# Altium schematic sheet Band Pass Filter.SchDoc
size 431 x 279 mm; Organization: ORGANIZATION; Address1: ADDRESS 1; Address2: ADDRESS 2; Address3: ADDRESS 3; Address4: ADDRESS 4; Revision: -; SheetNumber: 2; SheetTotal: 4; ENG_APP_DATE: --/--/--; DSN_APP_DATE: --/--/--; CHK_APP_DATE: --/--/--
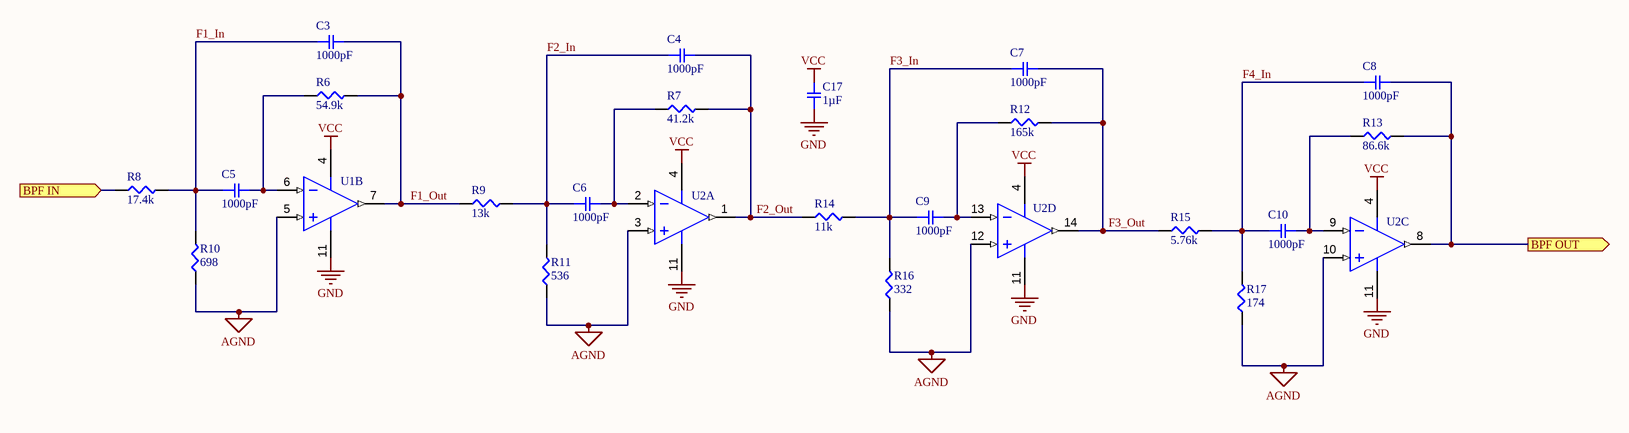
[diagram p0: Band Pass Filter.SchDoc]

## Parts
C3  1000pF  [SMD-0603C]
C4  1000pF  [SMD-0603C]
C5  1000pF  [SMD-0603C]
C6  1000pF  [SMD-0603C]
C7  1000pF  [SMD-0603C]
C8  1000pF  [SMD-0603C]
C9  1000pF  [SMD-0603C]
C10  1000pF  [SMD-0603C]
C17  1µF  [SMD-0603C]
R6  54.9k  [SMD-0603-RES]
R7  41.2k  [SMD-0603-RES]
R8  17.4k  [SMD-0603-RES]
R9  13k  [SMD-0603-RES]
R10  698  [SMD-0603-RES]
R11  536  [SMD-0603-RES]
R12  165k  [SMD-0603-RES]
R13  86.6k  [SMD-0603-RES]
R14  11k  [SMD-0603-RES]
R15  5.76k  [SMD-0603-RES]
R16  332  [SMD-0603-RES]
R17  174  [SMD-0603-RES]
U1  OPA1604AIPWR  [PW0014A_N]  (value not drawn)  (part B of 4)
U2  OPA1604AIPWR  [PW0014A_N]  (value not drawn)  (parts A,C,D of 4)

## Ports
BPF IN (in), BPF OUT (out)

## Nets
AGND: R10.1 R11.1 R16.1 R17.1 U1.5(IN_B+) U2.3(IN_A+) U2.10(IN_C+) U2.12(IN_D+)
GND: C17.1 U1.11(V-) U2.11(V-)
VCC: C17.2 U1.4(V+) U2.4(V+)
BPF IN: R8.1 ; port BPF IN
BPF OUT: C8.2 R13.2 U2.8(OUT_C) ; port BPF OUT
F1_In: C3.1 C5.1 R8.2 R10.2
F1_Out: C3.2 R6.2 R9.1 U1.7(OUT_B)
F2_In: C4.1 C6.1 R9.2 R11.2
F2_Out: C4.2 R7.2 R14.1 U2.1(OUT_A)
F3_In: C7.1 C9.1 R14.2 R16.2
F3_Out: C7.2 R12.2 R15.1 U2.14(OUT_D)
F4_In: C8.1 C10.1 R15.2 R17.2
NetC5_2: C5.2 R6.1 U1.6(IN_B-)
NetC6_2: C6.2 R7.1 U2.2(IN_A-)
NetC9_2: C9.2 R12.1 U2.13(IN_D-)
NetC10_2: C10.2 R13.1 U2.9(IN_C-)

## Notes on the sheet
- DWG. NO.
- REV.
- SHT.
- THIS DOCUMENT AND THE DATA DISCLOSED HEREIN OR HEREWITH IS THE PROPERTY OF ALTIUM LIMITED AND MAY BE FREELY DISTRIBUTED IN WHOLE. NO RIGHTS ARE RESERVED OR EXPRESS OR IMPLIED WARANTEE GIVEN.
- REVISION
- DESCRIPTION
- DATE
- APPROVED
- ENG:
- APPROVALS
- PROJECT
- DSN:
- CHK:
- REFERENCE DOCUMENTS
- PROJECT REVISION:
- TITLE
- DOCUMENT REVISION:
- DESIGN ITEM:
- BOM:
- FAB DWG:
- PCB DWG:
- ASSY DWG:
- SCALE:
- SIZE
- B
- CAGE CODE
- FILE NAME
- DWG NO.
- SHEET
- OF
- REV

## Library data of the parts
C3-C10 = GCJ188R71H102KA01D: CAP CER 1000PF 50V X7R 0603; Manufacturer: Walsin Technology Corporation; Manufacturer Part Number: 0603N102F500CT; Value: 1000pF; Operating Temperature: -55°C ~ 125°C; Package / Case: 0603 (1608 Metric); Datasheet Link: https://www.digikey.com/en/products/detail/walsin-technology-corporation/0603N102F500CT/9354972
C17 = GCM188R71C105KA64D: CAP CER 1UF 16V X7R 0603; Manufacturer: Samsung Electro-Mechanics; Manufacturer Part Number: CL10A105KA8NNNC; Value: 1µF; Operating Temperature: -55°C ~ 125°C; Package / Case: 0603 (1608 Metric); Datasheet Link: https://www.digikey.com/en/products/detail/samsung-electro-mechanics/CL10A105KA8NNNC/3886760
R6 = ERJ-3EKF5492V: RES SMD 54.9K OHM 1% 1/10W 0603; Manufacturer: Panasonic Electronic Components; Value: 54.9k; Operating Temperature: -55°C ~ 155°C; Package / Case: 0603 (1608 Metric); Datasheet Link: https://www.digikey.com/en/products/detail/panasonic-electronic-components/ERJ-3EKF5492V/196403; Manufacturer Part Number: ERJ-3EKF5492V
R7 = ERJ-3EKF4122V: RES SMD 41.2K OHM 1% 1/10W 0603; Manufacturer: Panasonic Electronic Components; Value: 41.2k; Operating Temperature: -55°C ~ 155°C; Package / Case: 0603 (1608 Metric); Datasheet Link: https://www.digikey.com/en/products/detail/yageo/RC0603FR-0741K2L/727225; Manufacturer Part Number: ERJ-3EKF4122V
R8 = ERJ-3EKF1742V: RES SMD 17.4K OHM 1% 1/10W 0603; Manufacturer: Panasonic Electronic Components; Value: 17.4k; Operating Temperature: -55°C ~ 155°C; Package / Case: 0603 (1608 Metric); Datasheet Link: https://www.digikey.com/en/products/detail/panasonic-electronic-components/ERJ-3EKF1742V/196159; Manufacturer Part Number: ERJ-3EKF1742V
R9 = ERJ-3EKF1302V: RES SMD 13K OHM 1% 1/10W 0603; Manufacturer: Panasonic Electronic Components; Value: 13k; Operating Temperature: -55°C ~ 155°C; Package / Case: 0603 (1608 Metric); Datasheet Link: https://www.digikey.com/en/products/detail/panasonic-electronic-components/ERJ-3EKF1302V/196110; Manufacturer Part Number: ERJ-3EKF1302V
R10 = ERJ-3EKF6980V: RES SMD 698 OHM 1% 1/10W 0603; Manufacturer: Panasonic Electronic Components; Value: 698; Operating Temperature: -55°C ~ 155°C; Package / Case: 0603 (1608 Metric); Datasheet Link: https://www.digikey.com/en/products/detail/panasonic-electronic-components/ERJ-3EKF6980V/196453; Manufacturer Part Number: ERJ-3EKF6980V
R11 = ERJ-3EKF5360V: RES SMD 536 OHM 1% 1/10W 0603; Manufacturer: Panasonic Electronic Components; Value: 536; Operating Temperature: -55°C ~ 155°C; Package / Case: 0603 (1608 Metric); Datasheet Link: https://www.digikey.com/en/products/detail/panasonic-electronic-components/ERJ-3EKF5360V/196400; Manufacturer Part Number: ERJ-3EKF5360V
R12 = ERJ-3EKF1653V: RES SMD 165K OHM 1% 1/10W 0603; Manufacturer: Panasonic Electronic Components; Value: 165k; Operating Temperature: -55°C ~ 155°C; Package / Case: 0603 (1608 Metric); Datasheet Link: https://www.digikey.com/en/products/detail/panasonic-electronic-components/ERJ-3EKF1653V/196155; Manufacturer Part Number: ERJ-3EKF1653V
R13 = ERJ-3EKF8662V: RES SMD 86.6K OHM 1% 1/10W 0603; Manufacturer: Panasonic Electronic Components; Value: 86.6k; Operating Temperature: -55°C ~ 155°C; Package / Case: 0603 (1608 Metric); Datasheet Link: https://www.digikey.com/en/products/detail/panasonic-electronic-components/ERJ-3EKF8662V/196500; Manufacturer Part Number: ERJ-3EKF8662V
R14 = ERJ-3EKF1102V: RES SMD 11K OHM 1% 1/10W 0603; Manufacturer: Panasonic Electronic Components; Value: 11k; Operating Temperature: -55°C ~ 155°C; Package / Case: 0603 (1608 Metric); Datasheet Link: https://www.digikey.com/en/products/detail/panasonic-electronic-components/ERJ-3EKF1102V/196083; Manufacturer Part Number: ERJ-3EKF1102V
R15 = ERJ-3EKF5761V: RES SMD 5.76K OHM 1% 1/10W 0603; Manufacturer: Panasonic Electronic Components; Value: 5.76k; Operating Temperature: -55°C ~ 155°C; Package / Case: 0603 (1608 Metric); Datasheet Link: https://www.digikey.com/en/products/detail/panasonic-electronic-components/ERJ-3EKF5761V/196388; Manufacturer Part Number: ERJ-3EKF5761V
R16 = ERJ-3EKF3320V: RES SMD 332 OHM 1% 1/10W 0603; Manufacturer: Panasonic Electronic Components; Value: 332; Operating Temperature: -55°C ~ 155°C; Package / Case: 0603 (1608 Metric); Datasheet Link: https://www.digikey.com/en/products/detail/panasonic-electronic-components/ERJ-3EKF3320V/196300; Manufacturer Part Number: ERJ-3EKF3320V
R17 = ERJ-3EKF1740V: RES SMD 174 OHM 1% 1/10W 0603; Manufacturer: Panasonic Electronic Components; Value: 174; Operating Temperature: -55°C ~ 155°C; Package / Case: 0603 (1608 Metric); Datasheet Link: https://www.digikey.com/en/products/detail/panasonic-electronic-components/ERJ-3EKF1740V/196162; Manufacturer Part Number: ERJ-3EKF1740V
U1 U2 = CMP-0272-01731-3: Sound Plus High-Performance, Bipolar-Input Audio Operational Amplifier, 4.5 to 36 V, -40 to 85 degC, 14-pin SOP (PW14), Green (RoHS & no Sb/Br); Manufacturer: Texas Instruments; Datasheet Link: https://www.digikey.com/en/products/detail/texas-instruments/OPA1604AIPWR/2793768; Manufacturer Part Number: OPA1604AIPWR; Operating Temperature: -40°C ~ 85°C; Package / Case: 14-TSSOP